# EasyEDA Pro project uven2-mk3-cc-interface.eprj

# Schematic Schematic1
Board Name: Board1; Create Date: 2025-06-02; Page Name: P1; Project Name: uven2-mk3-cc-interface; Schematic Name: Schematic1; Update Date: 2025-06-08; Company: EasyEDA.com; Page Size: A4; Version: V1.0
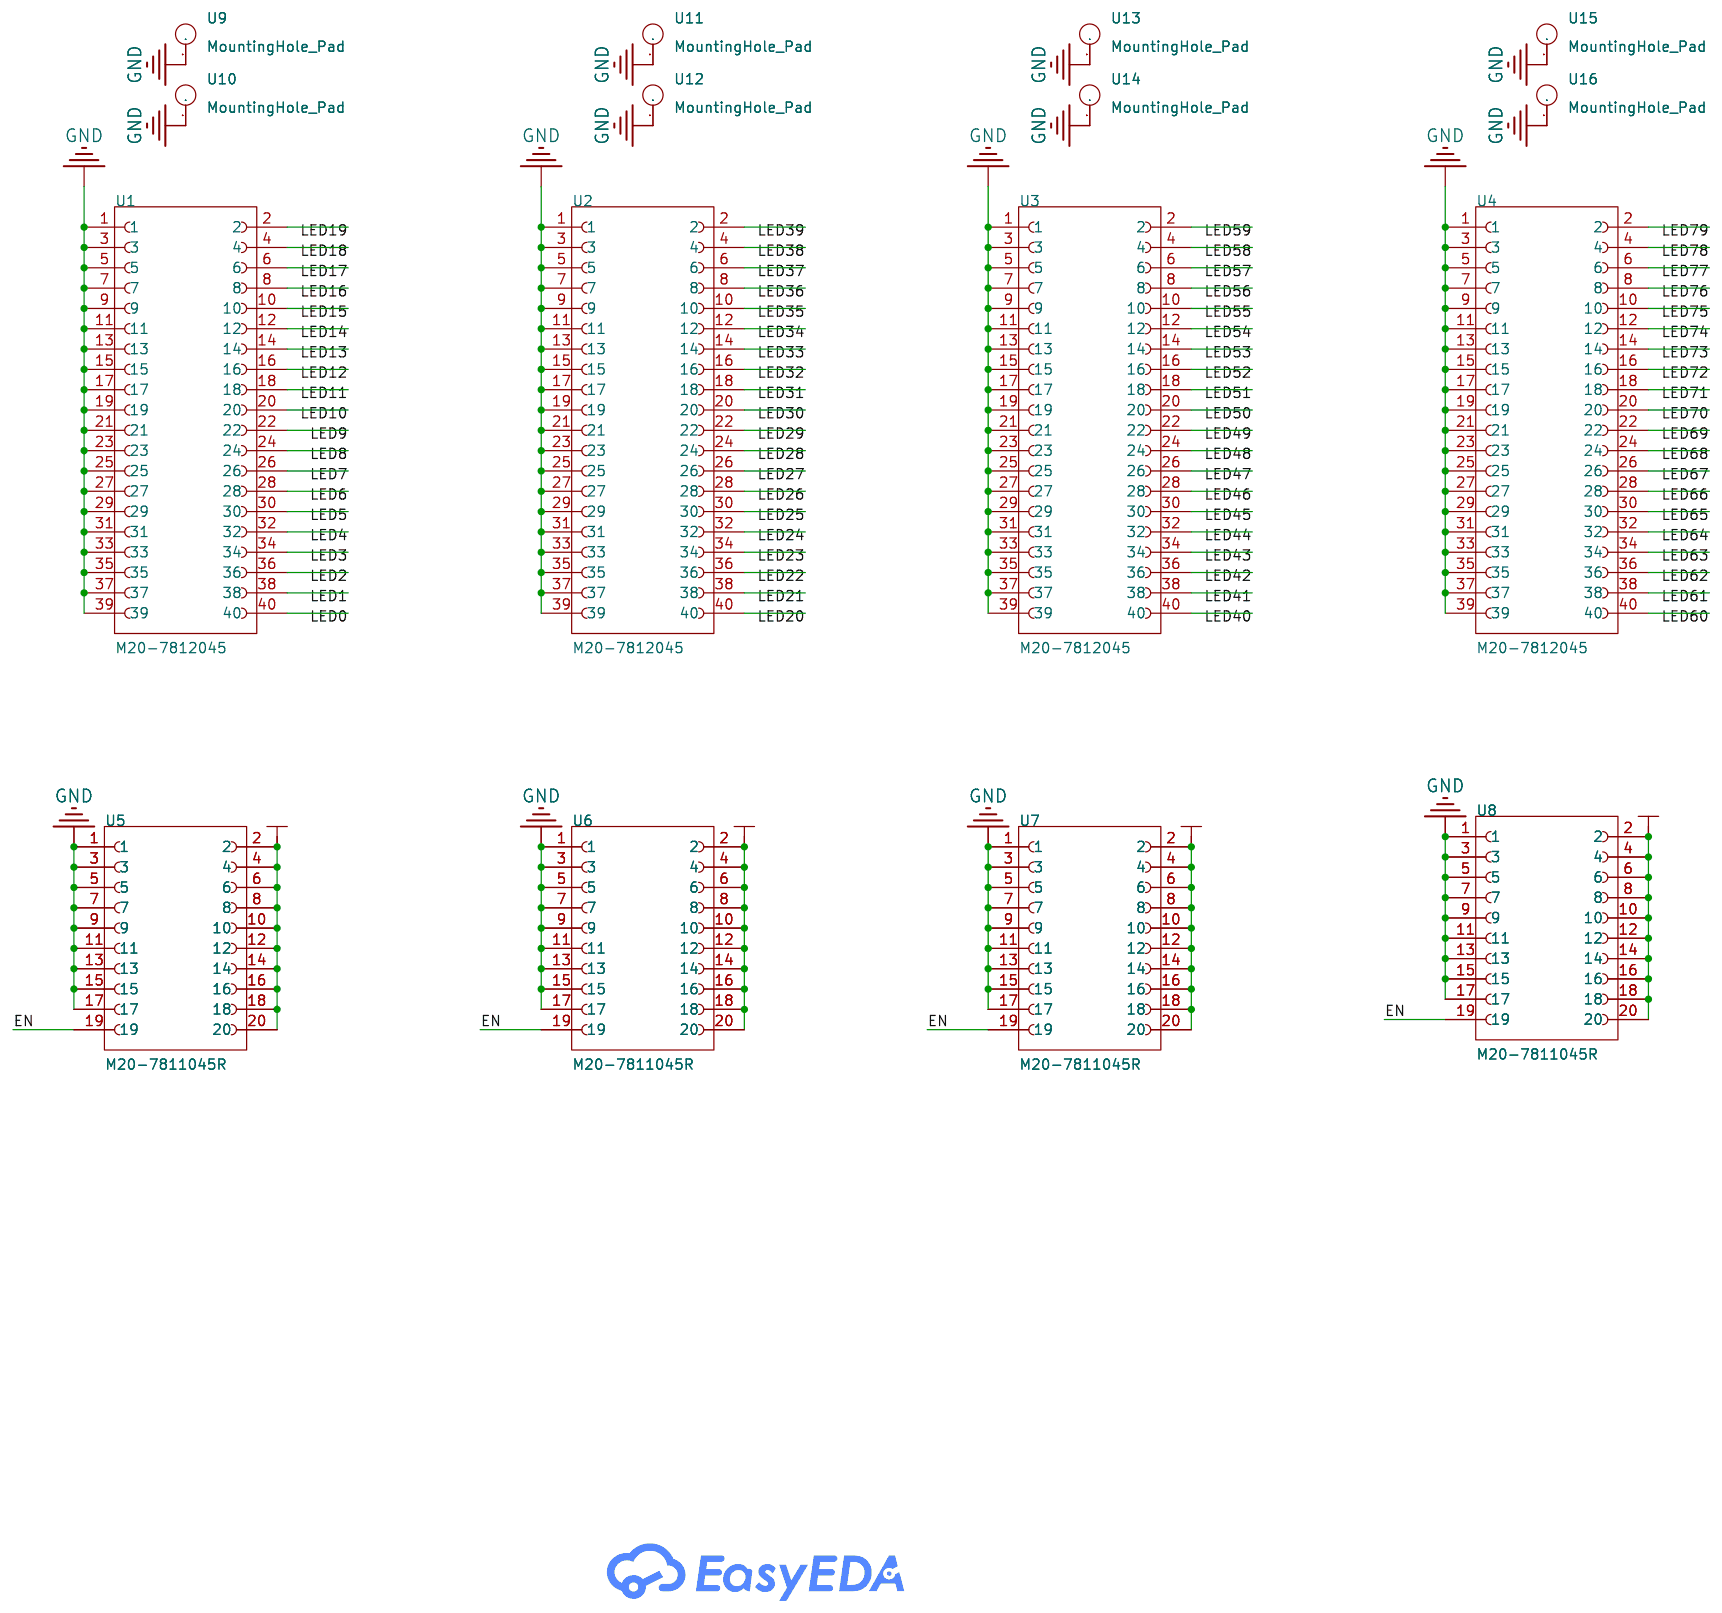
[diagram p0: schematic sheet]

## Parts
U1  M20-7812045  [HARWIN_M20-7812045]
U2  M20-7812045  [HARWIN_M20-7812045]
U3  M20-7812045  [HARWIN_M20-7812045]
U4  M20-7812045  [HARWIN_M20-7812045]
U5  M20-7811045R  [HARWIN_M20-7811045R]
U6  M20-7811045R  [HARWIN_M20-7811045R]
U7  M20-7811045R  [HARWIN_M20-7811045R]
U8  M20-7811045R  [HARWIN_M20-7811045R]
U9  MountingHole_Pad  [MountingHole_3.2mm_M3_DIN965_Pad_TopOnly]
U10  MountingHole_Pad  [MountingHole_3.2mm_M3_DIN965_Pad_TopOnly]
U11  MountingHole_Pad  [MountingHole_3.2mm_M3_DIN965_Pad_TopOnly]
U12  MountingHole_Pad  [MountingHole_3.2mm_M3_DIN965_Pad_TopOnly]
U13  MountingHole_Pad  [MountingHole_3.2mm_M3_DIN965_Pad_TopOnly]
U14  MountingHole_Pad  [MountingHole_3.2mm_M3_DIN965_Pad_TopOnly]
U15  MountingHole_Pad  [MountingHole_3.2mm_M3_DIN965_Pad_TopOnly]
U16  MountingHole_Pad  [MountingHole_3.2mm_M3_DIN965_Pad_TopOnly]

## Library data of the parts
U1-U4 = M20-7812045
U5-U8 = M20-7811045R
U9-U16 = MountingHole_Pad

## Nets
+12V: U5.2 U5.4 U5.6 U5.8 U5.10 U5.12 U5.14 U5.16 U5.18 U5.20 U6.2 U6.4 U6.6 U6.8 U6.10 U6.12 U6.14 U6.16 U6.18 U6.20 U7.2 U7.4 U7.6 U7.8 U7.10 U7.12 U7.14 U7.16 U7.18 U7.20 U8.2 U8.4 U8.6 U8.8 U8.10 U8.12 U8.14 U8.16 U8.18 U8.20
GND: U1.1 U1.3 U1.5 U1.7 U1.9 U1.11 U1.13 U1.15 U1.17 U1.19 U1.21 U1.23 U1.25 U1.27 U1.29 U1.31 U1.33 U1.35 U1.37 U1.39 U2.1 U2.3 U2.5 U2.7 U2.9 U2.11 U2.13 U2.15 U2.17 U2.19 U2.21 U2.23 U2.25 U2.27 U2.29 U2.31 U2.33 U2.35 U2.37 U2.39 U3.1 U3.3 U3.5 U3.7 U3.9 U3.11 U3.13 U3.15 U3.17 U3.19 U3.21 U3.23 U3.25 U3.27 U3.29 U3.31 U3.33 U3.35 U3.37 U3.39 U4.1 U4.3 U4.5 U4.7 U4.9 U4.11 U4.13 U4.15 U4.17 U4.19 U4.21 U4.23 U4.25 U4.27 U4.29 U4.31 U4.33 U4.35 U4.37 U4.39 U5.1 U5.3 U5.5 U5.7 U5.9 U5.11 U5.13 U5.15 U5.17 U6.1 U6.3 U6.5 U6.7 U6.9 U6.11 U6.13 U6.15 U6.17 U7.1 U7.3 U7.5 U7.7 U7.9 U7.11 U7.13 U7.15 U7.17 U8.1 U8.3 U8.5 U8.7 U8.9 U8.11 U8.13 U8.15 U8.17 U9.1 U10.1 U11.1 U12.1 U13.1 U14.1 U15.1 U16.1
EN: U5.19 U6.19 U7.19 U8.19
LED0: U1.40
LED1: U1.38
LED2: U1.36
LED3: U1.34
LED4: U1.32
LED5: U1.30
LED6: U1.28
LED7: U1.26
LED8: U1.24
LED9: U1.22
LED10: U1.20
LED11: U1.18
LED12: U1.16
LED13: U1.14
LED14: U1.12
LED15: U1.10
LED16: U1.8
LED17: U1.6
LED18: U1.4
LED19: U1.2
LED20: U2.40
LED21: U2.38
LED22: U2.36
LED23: U2.34
LED24: U2.32
LED25: U2.30
LED26: U2.28
LED27: U2.26
LED28: U2.24
LED29: U2.22
LED30: U2.20
LED31: U2.18
LED32: U2.16
LED33: U2.14
LED34: U2.12
LED35: U2.10
LED36: U2.8
LED37: U2.6
LED38: U2.4
LED39: U2.2
LED40: U3.40
LED41: U3.38
LED42: U3.36
LED43: U3.34
LED44: U3.32
LED45: U3.30
LED46: U3.28
LED47: U3.26
LED48: U3.24
LED49: U3.22
LED50: U3.20
LED51: U3.18
LED52: U3.16
LED53: U3.14
LED54: U3.12
LED55: U3.10
LED56: U3.8
LED57: U3.6
LED58: U3.4
LED59: U3.2
LED60: U4.40
LED61: U4.38
LED62: U4.36
LED63: U4.34
LED64: U4.32
LED65: U4.30
LED66: U4.28
LED67: U4.26
LED68: U4.24
LED69: U4.22
LED70: U4.20
LED71: U4.18
LED72: U4.16
LED73: U4.14
LED74: U4.12
LED75: U4.10
LED76: U4.8
LED77: U4.6
LED78: U4.4
LED79: U4.2

# Board PCB1
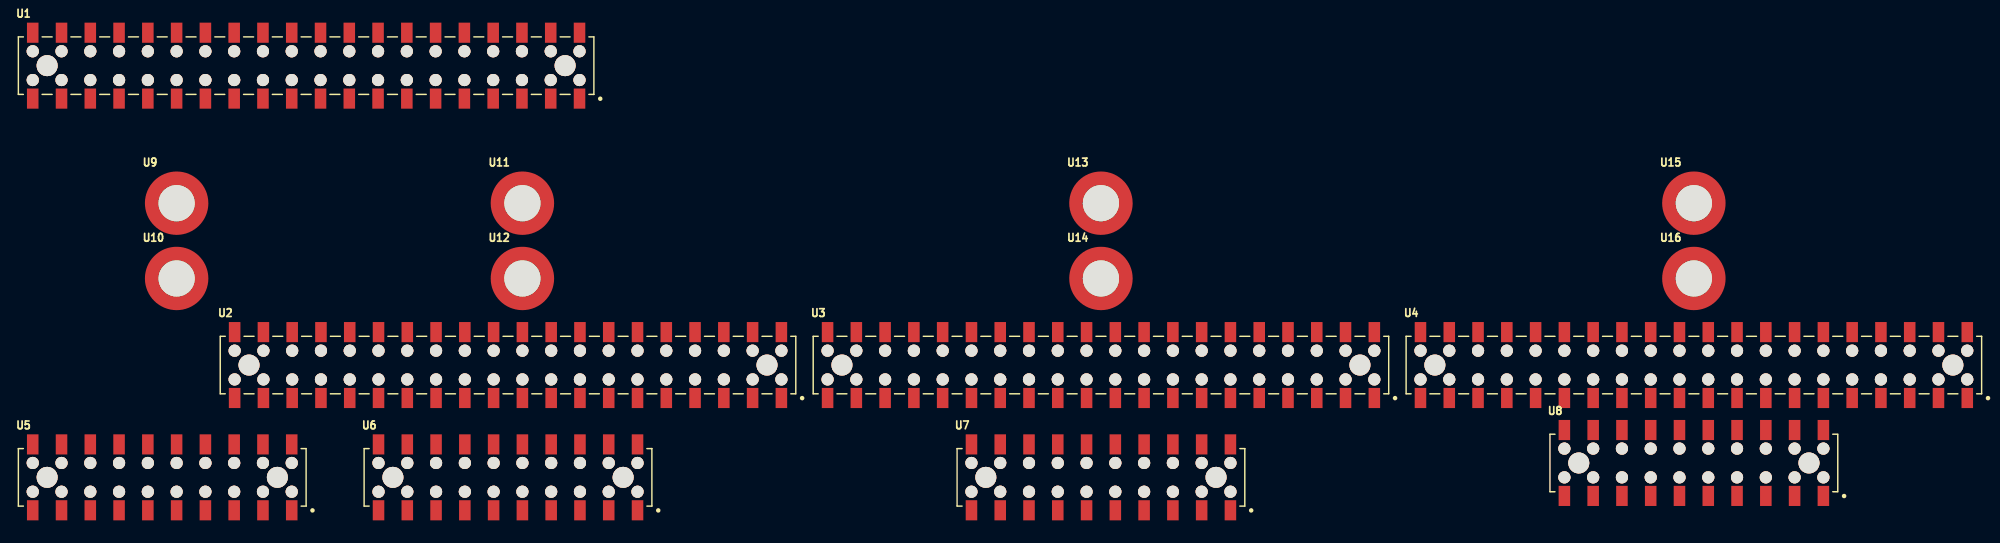
[diagram p1: board, top side]
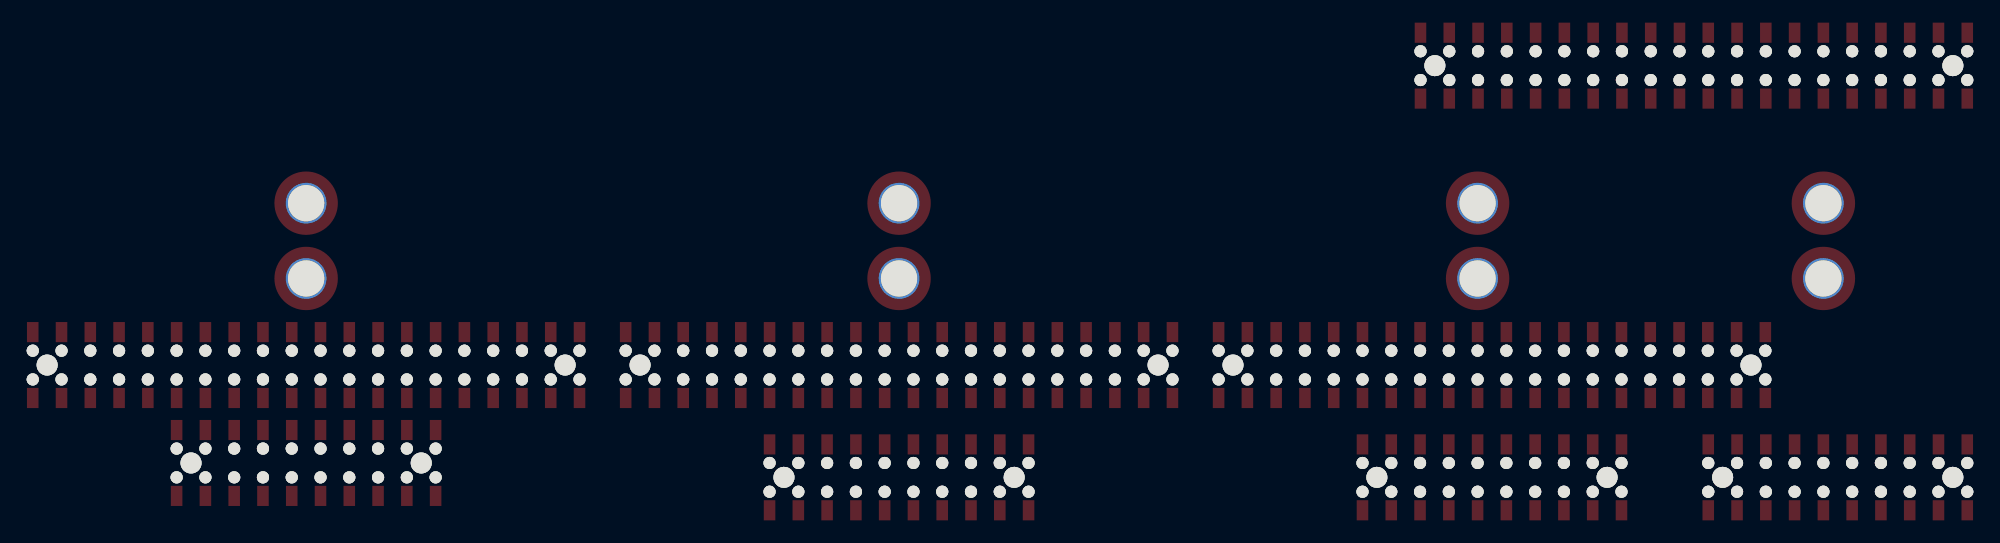
[diagram p2: board, bottom side, seen from below]

No outline. copper layers: Top Layer, Bottom Layer. Coordinates in mm from the lowest, leftmost part position.
Stack: Top Layer 0.035mm / Dielectric1 1.51mm FR4 er 4.5 / Bottom Layer 0.035mm

## Design rules (mm)
template: JLCPCB Capability(Two Layers Board)
spacing copperThickness1oz (default): track to track 0.102, other pairs 0.152 to 0.3
spacing copperThickness2oz: track to track 0.203, other pairs 0.152 to 0.3
track width copperThickness1oz (default): min 0.127, default 0.254, max 2.54
track width copperThickness2oz: min 0.203, default 0.254, max 2.54
differential pair differentialPair (default): width min 0.127, default 0.254, max 2.54; gap min 0.152, default 0.152
via viaSize (default): diameter min 0.5, default 0.61, max 10; hole min 0.3, default 0.305, max 6.3

## Placement (name value [footprint] x y rotation side)
U1  M20-7812045  [HARWIN_M20-7812045]  12.7 36.37 0 top
U2  M20-7812045  [HARWIN_M20-7812045]  30.52 9.92 0 top
U3  M20-7812045  [HARWIN_M20-7812045]  82.86 9.92 0 top
U4  M20-7812045  [HARWIN_M20-7812045]  135.19 9.92 0 top
U5  M20-7811045R  [HARWIN_M20-7811045R]  0 0 0 top
U6  M20-7811045R  [HARWIN_M20-7811045R]  30.52 0 0 top
U7  M20-7811045R  [HARWIN_M20-7811045R]  82.86 0 0 top
U8  M20-7811045R  [HARWIN_M20-7811045R]  135.19 1.27 0 top
U9  MountingHole_Pad  [MountingHole_3.2mm_M3_DIN965_Pad_TopOnly]  1.27 24.22 0 top
U10  MountingHole_Pad  [MountingHole_3.2mm_M3_DIN965_Pad_TopOnly]  1.27 17.57 0 top
U11  MountingHole_Pad  [MountingHole_3.2mm_M3_DIN965_Pad_TopOnly]  31.79 24.22 0 top
U12  MountingHole_Pad  [MountingHole_3.2mm_M3_DIN965_Pad_TopOnly]  31.79 17.57 0 top
U13  MountingHole_Pad  [MountingHole_3.2mm_M3_DIN965_Pad_TopOnly]  82.86 24.22 0 top
U14  MountingHole_Pad  [MountingHole_3.2mm_M3_DIN965_Pad_TopOnly]  82.86 17.57 0 top
U15  MountingHole_Pad  [MountingHole_3.2mm_M3_DIN965_Pad_TopOnly]  135.19 24.22 0 top
U16  MountingHole_Pad  [MountingHole_3.2mm_M3_DIN965_Pad_TopOnly]  135.19 17.57 0 top

## Footprints (pads in the part's own frame, mm; a bottom-side part is the same pattern mirrored in y, then rotated)
HARWIN_M20-7811045R
  rect 1.02x1.78 smd: 1(11.43,-2.91) 2(11.43,2.91) 3(8.89,-2.91) 4(8.89,2.91) 5(6.35,-2.91) 6(6.35,2.91) 7(3.81,-2.91) 8(3.81,2.91) 9(1.27,-2.91) 10(1.27,2.91) 11(-1.27,-2.91) 12(-1.27,2.91) 13(-3.81,-2.91) 14(-3.81,2.91) 15(-6.35,-2.91) 16(-6.35,2.91) 17(-8.89,-2.91) 18(-8.89,2.91) 19(-11.43,-2.91) 20(-11.43,2.91)
  round 1.07 hole 1.07: None(-11.43,1.27) None(-11.43,-1.27) None(-8.89,1.27) None(-8.89,-1.27) None(-6.35,1.27) None(-6.35,-1.27) None(-3.81,1.27) None(-3.81,-1.27) None(-1.27,1.27) None(-1.27,-1.27) None(1.27,1.27) None(1.27,-1.27) None(3.81,1.27) None(3.81,-1.27) None(6.35,1.27) None(6.35,-1.27) None(8.89,1.27) None(8.89,-1.27) None(11.43,1.27) None(11.43,-1.27)
  round 1.85 hole 1.85: None(-10.16,0) None(10.16,0)
HARWIN_M20-7812045
  rect 1.02x1.78 smd: 1(24.13,-2.91) 2(24.13,2.91) 3(21.59,-2.91) 4(21.59,2.91) 5(19.05,-2.91) 6(19.05,2.91) 7(16.51,-2.91) 8(16.51,2.91) 9(13.97,-2.91) 10(13.97,2.91) 11(11.43,-2.91) 12(11.43,2.91) 13(8.89,-2.91) 14(8.89,2.91) 15(6.35,-2.91) 16(6.35,2.91) 17(3.81,-2.91) 18(3.81,2.91) 19(1.27,-2.91) 20(1.27,2.91) 21(-1.27,-2.91) 22(-1.27,2.91) 23(-3.81,-2.91) 24(-3.81,2.91) 25(-6.35,-2.91) 26(-6.35,2.91) 27(-8.89,-2.91) 28(-8.89,2.91) 29(-11.43,-2.91) 30(-11.43,2.91) 31(-13.97,-2.91) 32(-13.97,2.91) 33(-16.51,-2.91) 34(-16.51,2.91) 35(-19.05,-2.91) 36(-19.05,2.91) 37(-21.59,-2.91) 38(-21.59,2.91) 39(-24.13,-2.91) 40(-24.13,2.91)
  round 1.07 hole 1.07: None(-24.13,1.27) None(-24.13,-1.27) None(-21.59,1.27) None(-21.59,-1.27) None(-19.05,1.27) None(-19.05,-1.27) None(-16.51,1.27) None(-16.51,-1.27) None(-13.97,1.27) None(-13.97,-1.27) None(-11.43,1.27) None(-11.43,-1.27) None(-8.89,1.27) None(-8.89,-1.27) None(-6.35,1.27) None(-6.35,-1.27) None(-3.81,1.27) None(-3.81,-1.27) None(-1.27,1.27) None(-1.27,-1.27) None(1.27,1.27) None(1.27,-1.27) None(3.81,1.27) None(3.81,-1.27) None(6.35,1.27) None(6.35,-1.27) None(8.89,1.27) None(8.89,-1.27) None(11.43,1.27) None(11.43,-1.27) None(13.97,1.27) None(13.97,-1.27) None(16.51,1.27) None(16.51,-1.27) None(19.05,1.27) None(19.05,-1.27) None(21.59,1.27) None(21.59,-1.27) None(24.13,1.27) None(24.13,-1.27)
  round 1.85 hole 1.85: None(-22.86,0) None(22.86,0)
MountingHole_3.2mm_M3_DIN965_Pad_TopOnly
  round 3.6 hole 3.2: 1(0,0)
  round 5.6 smd: 1(0,0)

## Nets
As in the schematic.

Pads without a net: U1 None; U2 None; U3 None; U4 None; U5 None; U6 None; U7 None; U8 None
